# EAGLE schematic Sch (EAGLE 7.5.0)
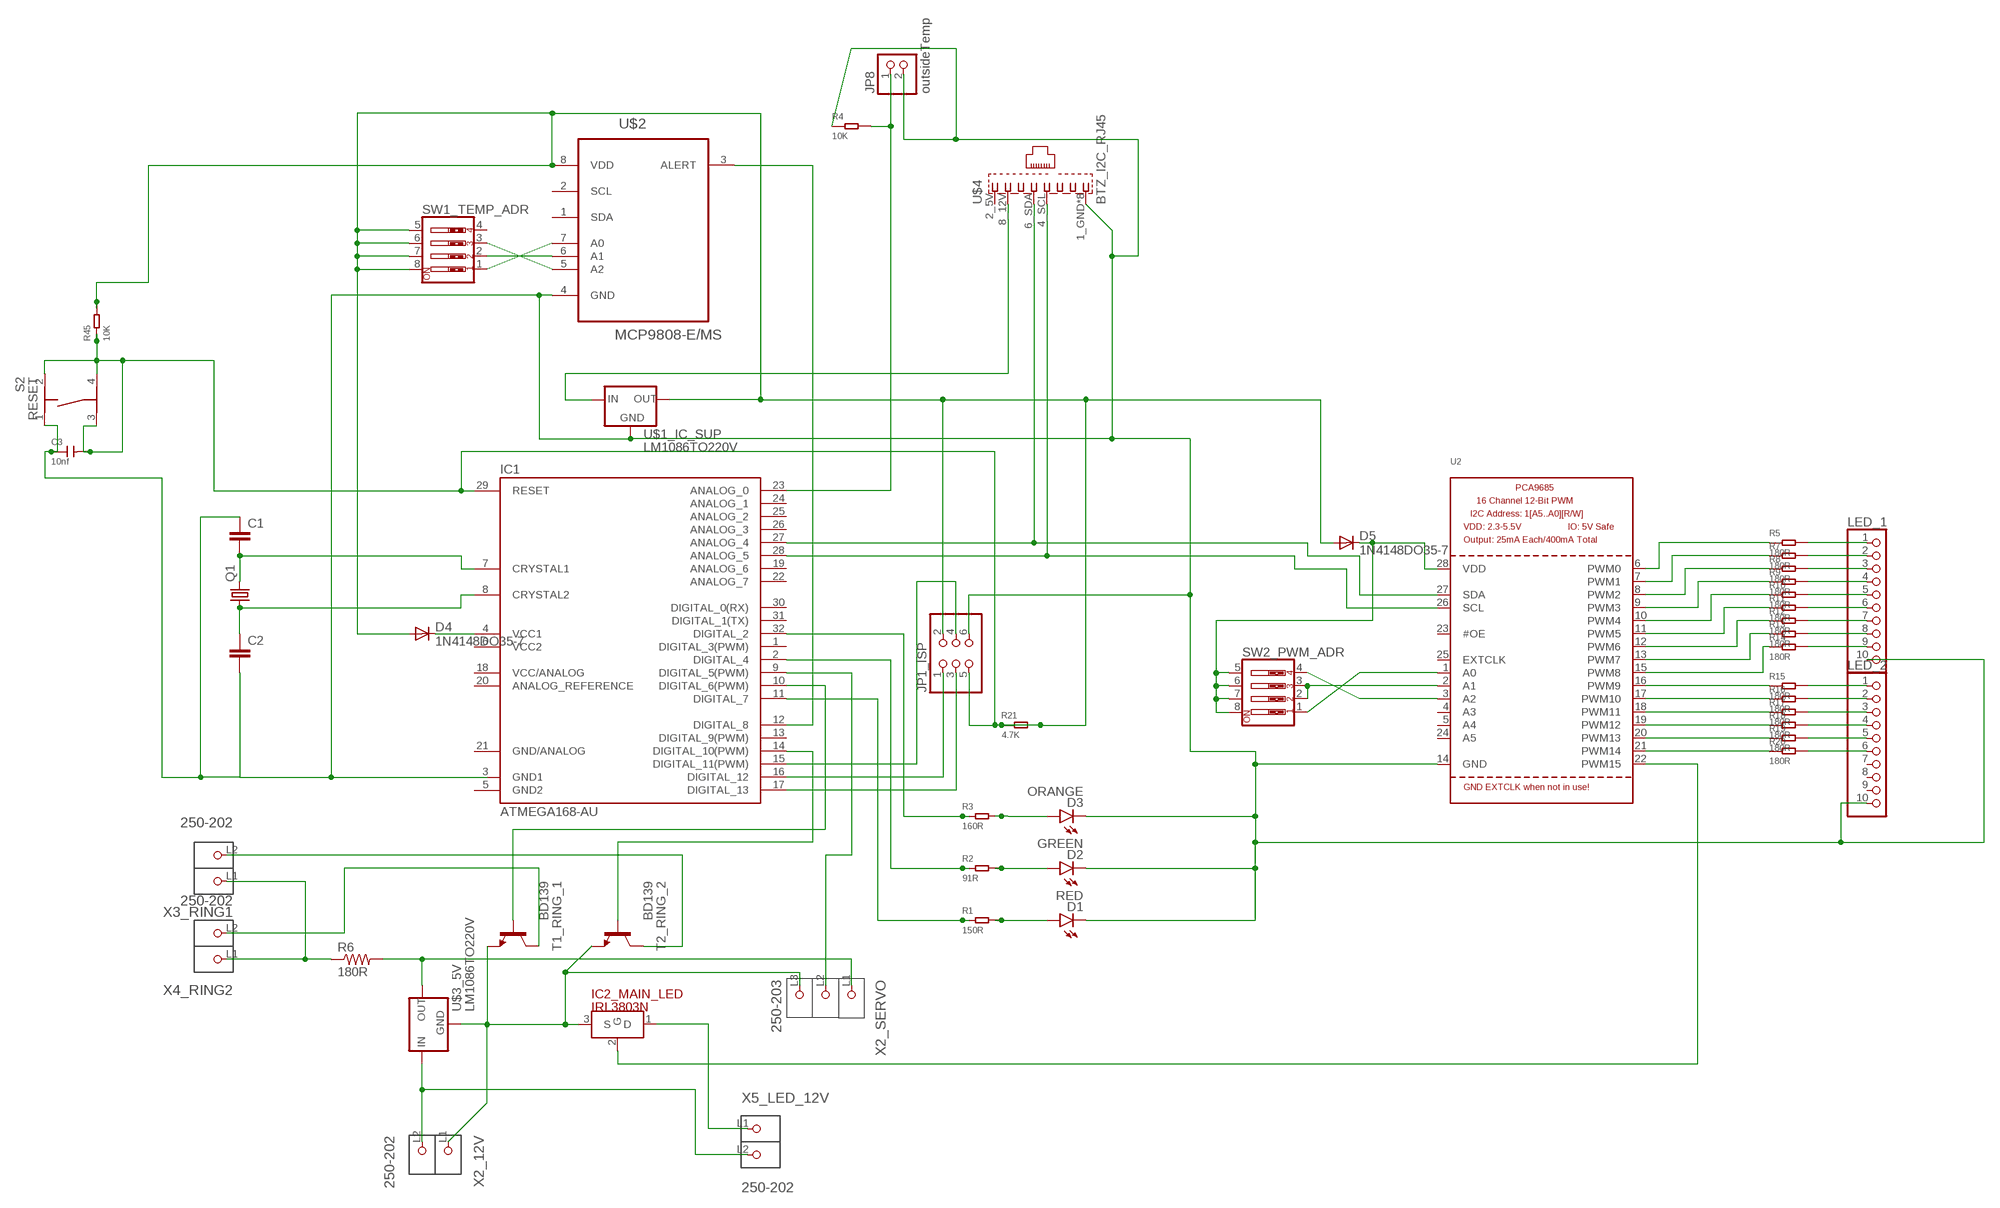
[diagram p0: schematic, sheet 1]

## Parts
C1  C-EU025-025X050  [C025-025X050]
C2  C-EU025-025X050  [C025-025X050]
C3  10nf  CERAMIC-10NF-50V-10%-X7R(0603)  [C0603]
D1  RED  LED-RED0603  [LED-0603]
D2  GREEN  LED-RED0603  [LED-0603]
D3  ORANGE  LED-RED0603  [LED-0603]
D4  1N4148DO35-7  [DO35-7]
D5  1N4148DO35-7  [DO35-7]
IC1  ATMEGA168-AU  [TQFP32-08]
IC2_MAIN_LED  IRL3803N  [TO220]
JP1_ISP  PINHD-2X3  [2X03]
JP8  outsideTemp  PINHD-1X2  [1X02]
LED_1  PINHD-1X10  [1X10]
LED_2  PINHD-1X10  [1X10]
Q1  CRYSTALHC49S  [HC49/S]
R1  150R  SMD-RES-100R-5%-1/10W(0603)  [R0603]
R2  91R  SMD-RES-100R-5%-1/10W(0603)  [R0603]
R3  160R  SMD-RES-100R-5%-1/10W(0603)  [R0603]
R4  10K  SMD-RES-10K-1%-1/10W(0603)  [R0603]
R5  180R  SMD-RES-100R-5%-1/10W(0603)  [R0603]
R6  180R  FLIPFLOP-RES  [0805-THM]
R7  180R  SMD-RES-100R-5%-1/10W(0603)  [R0603]
R8  180R  SMD-RES-100R-5%-1/10W(0603)  [R0603]
R9  180R  SMD-RES-100R-5%-1/10W(0603)  [R0603]
R10  180R  SMD-RES-100R-5%-1/10W(0603)  [R0603]
R11  180R  SMD-RES-100R-5%-1/10W(0603)  [R0603]
R12  180R  SMD-RES-100R-5%-1/10W(0603)  [R0603]
R13  180R  SMD-RES-100R-5%-1/10W(0603)  [R0603]
R14  180R  SMD-RES-100R-5%-1/10W(0603)  [R0603]
R15  180R  SMD-RES-100R-5%-1/10W(0603)  [R0603]
R16  180R  SMD-RES-100R-5%-1/10W(0603)  [R0603]
R17  180R  SMD-RES-100R-5%-1/10W(0603)  [R0603]
R18  180R  SMD-RES-100R-5%-1/10W(0603)  [R0603]
R19  180R  SMD-RES-100R-5%-1/10W(0603)  [R0603]
R20  180R  SMD-RES-100R-5%-1/10W(0603)  [R0603]
R21  4.7K  SMD-RES-4.7K-5%-1/10W(0603)  [R0603]
R45  10K  SMD-RES-10K-1%-1/10W(0603)  [R0603]
S2  RESET  TASTER-9314_SMD  [TASTER-9314_SMD]
SW1_TEMP_ADR  SW_DIP-4  [EDG-04]
SW2_PWM_ADR  SW_DIP-4  [EDG-04]
T1_RING_1  BD139  [TO126]
T2_RING_2  BD139  [TO126]
U2  PCA9685  [TSSOP28]
U$1_IC_SUP  LM1086TO220V  [TO220S]
U$2  MCP9808-E/MS  [SOP65P490X110-8N]
U$3_5V  LM1086TO220V  [TO220S]
U$4  BTZ_I2C_RJ45  [RJ45]
X2_12V  250-202  [P-250-202]
X2_SERVO  250-203  [P-250-203]
X3_RING1  250-202  [P-250-202]
X4_RING2  250-202  [P-250-202]
X5_LED_12V  250-202  [P-250-202]

## Nets
GND3: C1.1 C2.2 C3.1 D1.C D2.C D3.C JP1_ISP.6 JP8.2 LED_1.10 LED_2.10 R4.1 S2.1 U2.14(GND) U$1_IC_SUP.1(GND) U$2.4(GND) U$4.1_GND(GND) U$4.3_GND(GND) U$4.5_GND(GND) U$4.7_GND(GND) U$4.G1(GND) U$4.G2(GND) U$4.G3(GND) U$4.G4(GND)
N$1: SW2_PWM_ADR.1 U2.1(A0)
N$2: R5.1 U2.6(PWM0)
N$3: R7.1 U2.7(PWM1)
N$4: R8.1 U2.8(PWM2)
N$5: R9.1 U2.9(PWM3)
N$6: R10.1 U2.10(PWM4)
N$7: R11.1 U2.11(PWM5)
N$8: R12.1 U2.12(PWM6)
N$9: R13.1 U2.13(PWM7)
N$10: R14.1 U2.15(PWM8)
N$11: R15.1 U2.16(PWM9)
N$12: R16.1 U2.17(PWM10)
N$13: R17.1 U2.18(PWM11)
N$14: R18.1 U2.19(PWM12)
N$15: R19.1 U2.20(PWM13)
N$16: R20.1 U2.21(PWM14)
N$17: SW2_PWM_ADR.2 SW2_PWM_ADR.3 U2.2(A1)
N$19: SW1_TEMP_ADR.1 U$2.7(A0)
N$20: U$1_IC_SUP.3(IN) U$4.8_12V(12V)
N$21: SW1_TEMP_ADR.2 U$2.6(A1)
N$22: SW1_TEMP_ADR.3 U$2.5(A2)
N$23: SW2_PWM_ADR.4 U2.3(A2)
N$23_SCL: IC1.28(ANALOG_5) U2.26(SCL) U$4.4_SCL(SCL)
N$24: U$3_5V.3(IN) X2_12V.L2(P2) X5_LED_12V.L2(P2)
N$24_SDA: IC1.27(ANALOG_4) U2.27(SDA) U$4.6_SDA(SDA)
N$25: IC1.32(DIGITAL_2) R3.1
N$26: IC1.16(DIGITAL_12) JP1_ISP.1
N$27: IC1.2(DIGITAL_4) R2.1
N$28: D3.A R3.2
N$29: D2.A R2.2
N$30: D1.A R1.2
N$31: IC1.11(DIGITAL_7) R1.1
N$32: IC2_MAIN_LED.3(S) T1_RING_1.1(E) T2_RING_2.1(E) U$3_5V.1(GND) X2_12V.L1(P1) X2_SERVO.L3(P3)
N$33: IC1.17(DIGITAL_13) JP1_ISP.3
N$34: IC1.14(DIGITAL_10(PWM)) T2_RING_2.3(B)
N$35: T2_RING_2.2(C) X3_RING1.L2(P2)
N$36: T1_RING_1.2(C) X4_RING2.L2(P2)
N$37: R6.2 U$3_5V.2(OUT) X2_SERVO.L1(P1)
N$38: IC2_MAIN_LED.2(G) U2.22(PWM15)
N$39: IC2_MAIN_LED.1(D) X5_LED_12V.L1(P1)
N$40: D5.C SW2_PWM_ADR.5 SW2_PWM_ADR.6 SW2_PWM_ADR.7 SW2_PWM_ADR.8 U2.28(VDD)
N$41: IC1.23(ANALOG_0) JP8.1 R4.2
N$42: C2.1 IC1.8(CRYSTAL2) Q1.1
N$43: C1.2 IC1.7(CRYSTAL1) Q1.2
N$44: IC1.15(DIGITAL_11(PWM)) JP1_ISP.4
N$45: D4.C IC1.4(VCC1)
N$46: IC1.12(DIGITAL_8) U$2.3(ALERT)
N$47: IC1.10(DIGITAL_6(PWM)) T1_RING_1.3(B)
N$48: IC1.9(DIGITAL_5(PWM)) X2_SERVO.L2(P2)
N$49: R6.1 X3_RING1.L1(P1) X4_RING2.L1(P1)
N$50: LED_1.1 R5.2
N$51: LED_2.6 R20.2
N$52: LED_2.5 R19.2
N$53: LED_2.4 R18.2
N$54: LED_2.3 R17.2
N$55: LED_2.2 R16.2
N$56: LED_2.1 R15.2
N$57: LED_1.9 R14.2
N$58: LED_1.8 R13.2
N$59: LED_1.7 R12.2
N$60: LED_1.6 R11.2
N$61: LED_1.5 R10.2
N$62: LED_1.4 R9.2
N$63: LED_1.3 R8.2
N$64: LED_1.2 R7.2
N$105: C3.2 D4.A D5.A IC1.29(RESET) JP1_ISP.2 JP1_ISP.5 R21.1 R21.2 R45.1 R45.2 S2.2 S2.3 S2.4 SW1_TEMP_ADR.5 SW1_TEMP_ADR.6 SW1_TEMP_ADR.7 SW1_TEMP_ADR.8 U$1_IC_SUP.2(OUT) U$2.8(VDD)
Unconnected: IC1.1(DIGITAL_3(PWM)) IC1.13(DIGITAL_9(PWM)) IC1.18(VCC/ANALOG) IC1.19(ANALOG_6) IC1.20(ANALOG_REFERENCE) IC1.22(ANALOG_7) IC1.24(ANALOG_1) IC1.25(ANALOG_2) IC1.26(ANALOG_3) IC1.30(DIGITAL_0(RX)) IC1.31(DIGITAL_1(TX)) LED_2.7 LED_2.8 LED_2.9 SW1_TEMP_ADR.4 U2.4(A3) U2.5(A4) U2.23(#OE) U2.24(A5) U2.25(EXTCLK) U$2.1(SDA) U$2.2(SCL) U$4.2_5V(5V)

## Power pins joined to a net without a drawn wire
GND1: IC1.3(GND1)
GND2: IC1.5(GND2)
GND/ANALOG: IC1.21(GND/ANALOG)
VCC2: IC1.6(VCC2)

## Library data of the parts
C1 C2 = rcl:C-EU: CAPACITOR, European symbol
C3 = Seeed-Capacitor-2016:CERAMIC-10NF-50V-10%-X7R(0603): 302010140; MPN: CC0603KRX7R9BB103
D1 = SparkFun-LED:LED-RED: Assorted Red LEDs LilyPad 1206- DIO-09912 1206- DIO-00809 0603- DIO-00819 "SMART" means more efficient and expensive; PROD_ID: DIO-00819
D2 D3 = SparkFun-LED:LED-RED: Assorted Red LEDs LilyPad 1206- DIO-09912 1206- DIO-00809 0603- DIO-00819 "SMART" means more efficient and expensive; PROD_ID: DIO-00819; VALUE: RED
D4 D5 = diode:1N4148: DIODE high speed (Philips)
IC1 = Arduino-AVR:ATMEGA168
IC2_MAIN_LED = Btz:IRL3803
JP1_ISP = pinhead:PINHD-2X3: PIN HEADER
JP8 = pinhead:PINHD-1X2: PIN HEADER
LED_1 LED_2 = pinhead:PINHD-1X10: PIN HEADER
Q1 = crystal:CRYSTAL: CRYSTAL; OC_FARNELL: 1667008; OC_NEWARK: unknown
R1-R3 R5 R7-R20 = Seeed-Resistor-2016:SMD-RES-100R-5%-1/10W(0603): 301010090; MPN: RC0603JR-07100RL; VALUE: 100R
R4 R45 = Seeed-Resistor-2016:SMD-RES-10K-1%-1/10W(0603): 301010299; MPN: RC0603FR-0710KL
R6 = adafruit:FLIPFLOP-RES: Flip Flop resistor An 0805 resistor inside a standard 1/4W 5% resistor. Makes for easy mods
R21 = Seeed-Resistor-2016:SMD-RES-4.7K-5%-1/10W(0603): 301010290; MPN: RC0603JR-074K7L
S2 = Ergaenzung:TASTER-9314_SMD
SW1_TEMP_ADR SW2_PWM_ADR = special:SW_DIP-4: DIP SWITCH
T1_RING_1 T2_RING_2 = transistor:BD139: NPN TRANSISTOR
U2 = adafruit:PCA9685: PCA9685 - 16 Channel 12-Bit I2C PWM Controller 5.0V tolerant 16 channel, 12-bit I2C PWM controller with 25mA per output (max. 400mA total) Digikey: 568-5931-1-ND
U$1_IC_SUP U$3_5V = v-reg-2:LM1086
U$2 = mcp9808:MCP9808-E/MS: Digital Temperature Sensor,MSOP-8; MPN: MCP9808-E/MS; OC_FARNELL: 2080523; OC_NEWARK: 89T8871; PACKAGE: MSOP-8; SUPPLIER: MICROCHIP
U$4 = Btz:BTZ_I2C_RJ45
X2_12V X3_RING1 X4_RING2 X5_LED_12V = con-wago_250:250-202: Serie 250, 1-Leiter-Klemmenleiste für Leiterplatten 1 Lötstift/Pol versetzt / Series 250, 1-conductor PCB terminal strip 1 solder pin/pole, staggered Polzahl / Pole No.: 2 Rastermaß / Pitch: 3.5 - 3.5 mm Bemessungsspannung / Rated Voltage: 320 V Nennstrom / Nominal Current: 8 A Leiterquerschnitt / Conductor Size: 0.2 - 1.5 mm2 Anschlusstechnik / Connection Technology: CAGE CLAMP® S Lötstiftlänge: / Solder Pin Length: 3.6 mm Leitereinführung (zur Platine) / Conductor entry angle (to PCB): 45 ° Farbe / Color: grau / gray Stand: 01.01.2014. Die jeweils aktuellen Daten zu diesem Artikel finden Sie in unserem Produktkatalog, den Sie unter www.wago.com einsehen können. As of: 01/01/2014. Please find the newest data for this article in our product catalogue, which can be viewed under www.wago.com.
X2_SERVO = con-wago_250:250-203: Serie 250, 1-Leiter-Klemmenleiste für Leiterplatten 1 Lötstift/Pol versetzt / Series 250, 1-conductor PCB terminal strip 1 solder pin/pole, staggered Polzahl / Pole No.: 3 Rastermaß / Pitch: 3.5 - 3.5 mm Bemessungsspannung / Rated Voltage: 320 V Nennstrom / Nominal Current: 8 A Leiterquerschnitt / Conductor Size: 0.2 - 1.5 mm2 Anschlusstechnik / Connection Technology: CAGE CLAMP® S Lötstiftlänge: / Solder Pin Length: 3.6 mm Leitereinführung (zur Platine) / Conductor entry angle (to PCB): 45 ° Farbe / Color: grau / gray Stand: 01.01.2014. Die jeweils aktuellen Daten zu diesem Artikel finden Sie in unserem Produktkatalog, den Sie unter www.wago.com einsehen können. As of: 01/01/2014. Please find the newest data for this article in our product catalogue, which can be viewed under www.wago.com.